# EAGLE design TestBench_rev3 (EAGLE 6.4)
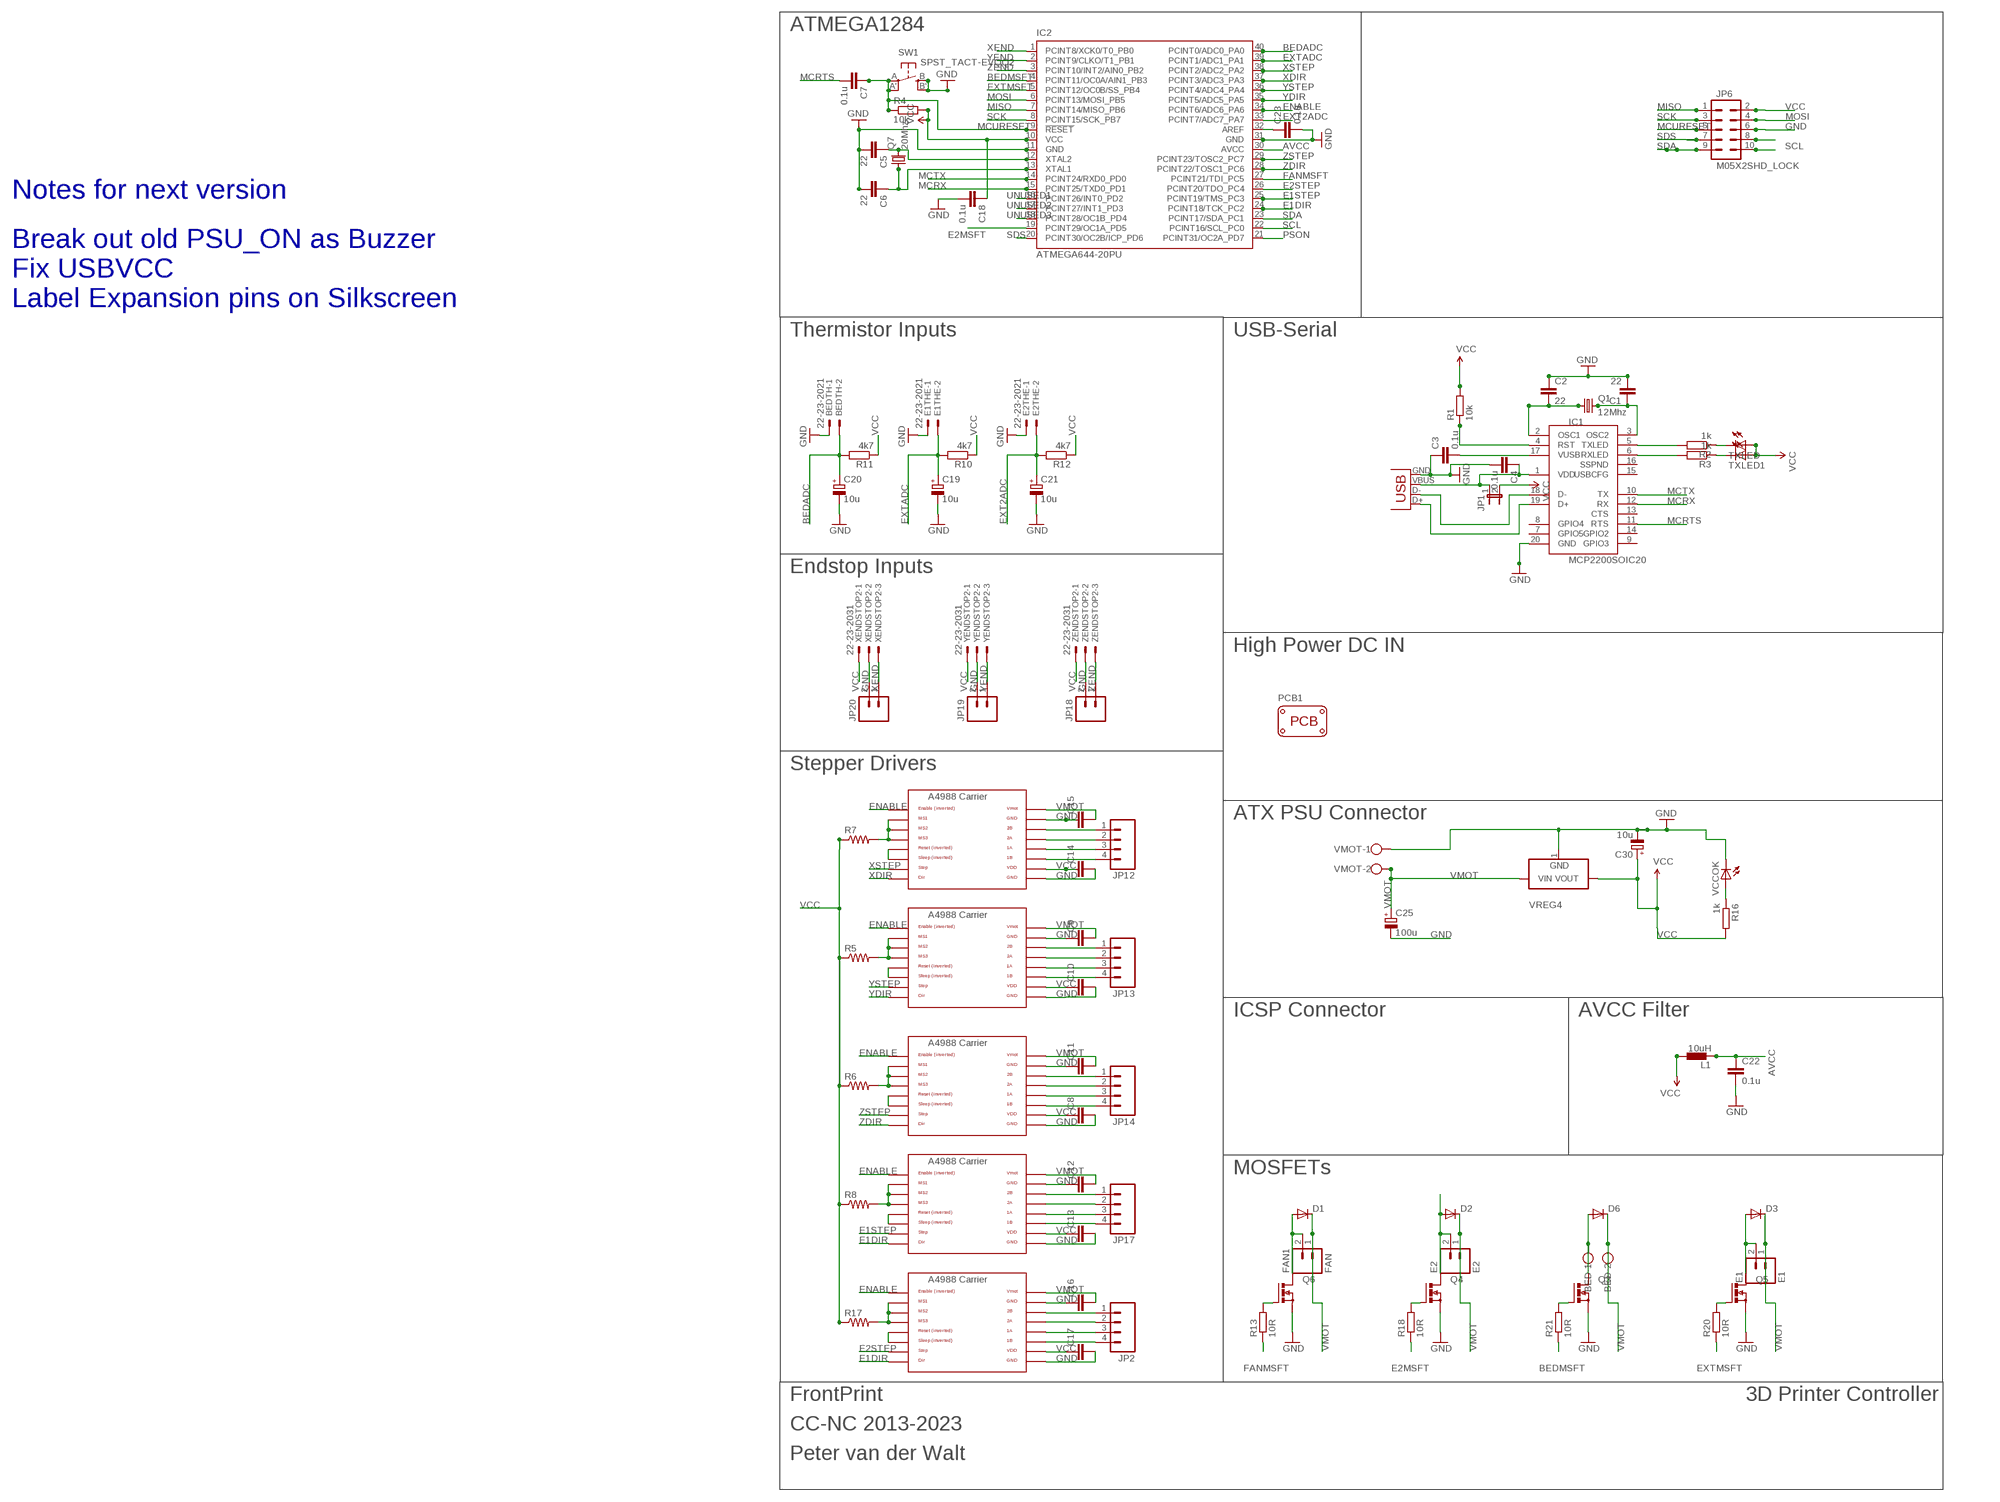
[diagram p0: schematic, sheet 1]

## Parts
BED  W237-102  [W237-102]
BEDTH  22-23-2021  [22-23-2021]
C1  22  CAP1206  [1206]
C2  22  CAP1206  [1206]
C3  0.1u  CAP1206  [1206]
C4  0.1u  CAP1206  [1206]
C5  22  CAP1206  [1206]
C6  22  CAP1206  [1206]
C7  0.1u  CAP1206  [1206]
C8  CAP1206  [1206]
C9  CAP1206  [1206]
C10  CAP1206  [1206]
C11  CAP1206  [1206]
C12  CAP1206  [1206]
C13  CAP1206  [1206]
C14  CAP1206  [1206]
C15  CAP1206  [1206]
C16  CAP1206  [1206]
C17  CAP1206  [1206]
C18  0.1u  CAP1206  [1206]
C19  10u  CPOL-EUE2.5-5  [E2,5-5]
C20  10u  CPOL-EUE2.5-5  [E2,5-5]
C21  10u  CPOL-EUE2.5-5  [E2,5-5]
C22  0.1u  CAP1206  [1206]
C23  0.1u  CAP1206  [1206]
C25  100u  CPOL-EUE5-8.5  [E5-8,5]
C30  10u  CPOL-EUE2-5  [E2-5]
D1  DIODESMA-ALT  [SMA-DIODE_ALT]
D2  DIODESMA-ALT  [SMA-DIODE_ALT]
D3  DIODESMA-ALT  [SMA-DIODE_ALT]
D6  DIODESMA-ALT  [SMA-DIODE_ALT]
E1  E1  M023.5MM  [SCREWTERMINAL-3.5MM-2]
E1POL  POLOLU_A4983CARRIER  [A4988BREAKOUT]
E1THE  22-23-2021  [22-23-2021]
E2  E2  M023.5MM  [SCREWTERMINAL-3.5MM-2]
E2POL  POLOLU_A4983CARRIER  [A4988BREAKOUT]
E2THE  22-23-2021  [22-23-2021]
FAN1  FAN  M023.5MM  [SCREWTERMINAL-3.5MM-2]
IC1  MCP2200SOIC20  [SOIC20]
IC2  ATMEGA644-20PU  [DIL40]
JP1  JUMPER-2PTH_LOCK  [1X02_LOCK]
JP2  M04SCREW  [SCREWTERMINAL-3.5MM-4]
JP6  M05X2SHD_LOCK  [2X5-SHROUDED_LOCK]
JP12  M04SCREW  [SCREWTERMINAL-3.5MM-4]
JP13  M04SCREW  [SCREWTERMINAL-3.5MM-4]
JP14  M04SCREW  [SCREWTERMINAL-3.5MM-4]
JP17  M04SCREW  [SCREWTERMINAL-3.5MM-4]
JP18  M023.5MM  [SCREWTERMINAL-3.5MM-2]
JP19  M023.5MM  [SCREWTERMINAL-3.5MM-2]
JP20  M023.5MM  [SCREWTERMINAL-3.5MM-2]
L1  10uH  BL01RN1A  [BL01RN1A]
PCB1  PCB_DP_SQUARE-10X10  [DP100100_V1]
Q1  12Mhz  CRYSTALHC49UP  [HC49UP]
Q3  PMOSFET_NTO220BV  [TO220BV]
Q4  PMOSFET_NTO220BV  [TO220BV]
Q5  PMOSFET_NTO220BV  [TO220BV]
Q6  PMOSFET_NTO220BV  [TO220BV]
Q7  20Mhz  CRYSTALHC49UP  [HC49UP]
R1  10k  R-EU_M1206  [M1206]
R2  1k  R-EU_M1206  [M1206]
R3  1k  R-EU_M1206  [M1206]
R4  10k  R-EU_M1206  [M1206]
R5  RESISTOR1206  [1206]
R6  RESISTOR1206  [1206]
R7  RESISTOR1206  [1206]
R8  RESISTOR1206  [1206]
R10  4k7  R-EU_M1206  [M1206]
R11  4k7  R-EU_M1206  [M1206]
R12  4k7  R-EU_M1206  [M1206]
R13  10R  R-EU_M1206  [M1206]
R16  1k  R-EU_M1206  [M1206]
R17  RESISTOR1206  [1206]
R18  10R  R-EU_M1206  [M1206]
R20  10R  R-EU_M1206  [M1206]
R21  10R  R-EU_M1206  [M1206]
SW1  SPST_TACT-EVQQ2  [EVQ-Q2]
TXLED  LEDSMT1206  [1206]
TXLED1  LEDSMT1206  [1206]
VCCOK  LEDSMT1206  [1206]
VMOT  W237-102  [W237-102]
VREG4  VREG_3PINS-DPAK  [DPAK]
X1  USBPTH  [USB-B-PTH]
XENDSTOP2  22-23-2031  [22-23-2031]
XPOL  POLOLU_A4983CARRIER  [A4988BREAKOUT]
YENDSTOP2  22-23-2031  [22-23-2031]
YPOL  POLOLU_A4983CARRIER  [A4988BREAKOUT]
ZENDSTOP2  22-23-2031  [22-23-2031]
ZPOL  POLOLU_A4983CARRIER  [A4988BREAKOUT]

## Nets
AVCC: C22.1 IC2.30(AVCC) L1.1
BEDADC: BEDTH.2 C20.+ IC2.40(PCINT0/ADC0_PA0) R11.2
BEDMSFT: IC2.4(PCINT11/OC0A/AIN1_PB3) R21.1
BEDOUT1: BED.1 D6.A Q3.D
BEDOUT2: D3.A E1.2 Q5.D
E1DIR: E1POL.DIR E2POL.DIR IC2.24(PCINT18/TCK_PC2)
E1OUT1: D2.A E2.2 Q4.D
E1STEP: E1POL.STEP IC2.25(PCINT19/TMS_PC3)
E2MSFT: IC2.19(PCINT29/OC1A_PD5) R18.1
E2STEP: E2POL.STEP IC2.26(PCINT20/TDO_PC4)
ENABLE: E1POL.EN E2POL.EN IC2.34(PCINT6/ADC6_PA6) XPOL.EN YPOL.EN ZPOL.EN
EXT2ADC: C21.+ E2THE.2 IC2.33(PCINT7/ADC7_PA7) R12.2
EXTADC: C19.+ E1THE.2 IC2.39(PCINT1/ADC1_PA1) R10.2
EXTMSFT: IC2.5(PCINT12/OC0B/SS_PB4) R20.1
FANMSFT: IC2.27(PCINT21/TDI_PC5) R13.1
FANOUT1: D1.A FAN1.2 Q6.D
GND: BEDTH.1 C1.2 C2.1 C3.1 C4.2 C5.2 C6.2 C8.2 C9.1 C10.2 C11.1 C12.1 C13.2 C14.2 C15.1 C16.1 C17.2 C18.2 C19.- C20.- C21.- C22.2 C23.2 C25.- C30.- E1POL.GND E1POL.GND@0(GND) E1THE.1 E2POL.GND E2POL.GND@0(GND) E2THE.1 IC1.20(GND) IC2.11(GND) IC2.31(GND) JP6.6 JP18.2 JP19.2 JP20.2 Q3.S Q4.S Q5.S Q6.S SW1.B'(S1) SW1.B(S) VCCOK.C VMOT.1 VREG4.1(GND) X1.GND XENDSTOP2.2 XPOL.GND XPOL.GND@0(GND) YENDSTOP2.2 YPOL.GND YPOL.GND@0(GND) ZENDSTOP2.2 ZPOL.GND ZPOL.GND@0(GND)
MCRTS: C7.2 IC1.11(RTS)
MCRX: IC1.12(RX) IC2.15(PCINT25/TXD0_PD1)
MCTX: IC1.10(TX) IC2.14(PCINT24/RXD0_PD0)
MCURESET: C7.1 IC2.9(!RESET) JP6.5 R4.1 SW1.A'(P1) SW1.A(P)
MISO: IC2.7(PCINT14/MISO_PB6) JP6.1
MOSI: IC2.6(PCINT13/MOSI_PB5) JP6.4
N$1: C2.2 IC1.2(OSC1) Q1.1
N$2: C1.1 IC1.3(OSC2) Q1.2
N$3: IC1.5(TXLED) R2.2
N$4: IC1.18(D-) X1.D-
N$5: IC1.19(D+) X1.D+
N$6: IC1.6(RXLED) R3.2
N$7: C3.2 IC1.17(VUSB)
N$8: E2POL.RST E2POL.SLP(SLEEP)
N$9: R2.1 TXLED.C
N$10: R3.1 TXLED1.C
N$11: C5.1 IC2.12(XTAL2) Q7.2
N$12: C6.1 IC2.13(XTAL1) Q7.1
N$13: IC1.4(RST) R1.1
N$14: E1POL.RST E1POL.SLP(SLEEP)
N$15: ZPOL.RST ZPOL.SLP(SLEEP)
N$16: YPOL.RST YPOL.SLP(SLEEP)
N$17: XPOL.RST XPOL.SLP(SLEEP)
N$18: R7.2 XPOL.MS1 XPOL.MS2 XPOL.MS3
N$19: R5.2 YPOL.MS1 YPOL.MS2 YPOL.MS3
N$20: E1POL.MS1 E1POL.MS2 E1POL.MS3 R8.2
N$21: R6.2 ZPOL.MS1 ZPOL.MS2 ZPOL.MS3
N$22: E1POL.1B JP17.4
N$23: E1POL.1A JP17.3
N$24: E1POL.2A JP17.2
N$25: E1POL.2B JP17.1
N$26: JP14.4 ZPOL.1B
N$27: JP14.3 ZPOL.1A
N$28: JP14.2 ZPOL.2A
N$29: JP14.1 ZPOL.2B
N$30: JP13.1 YPOL.2B
N$31: JP13.2 YPOL.2A
N$32: JP13.3 YPOL.1A
N$33: JP13.4 YPOL.1B
N$34: JP12.4 XPOL.1B
N$35: JP12.3 XPOL.1A
N$36: JP12.2 XPOL.2A
N$37: JP12.1 XPOL.2B
N$41: E2POL.MS1 E2POL.MS2 E2POL.MS3 R17.2
N$42: E2POL.1B JP2.4
N$43: E2POL.1A JP2.3
N$44: E2POL.2A JP2.2
N$45: E2POL.2B JP2.1
N$46: Q5.G R20.2
N$54: C23.1 IC2.32(AREF)
N$55: Q6.G R13.2
N$58: C4.1 IC1.1(VDD) JP1.1 X1.VBUS
N$61: Q4.G R18.2
N$64: R16.1 VCCOK.A
N$67: Q3.G R21.2
N$73: JP6.8
PSON: IC2.21(PCINT31/OC2A_PD7)
SCK: IC2.8(PCINT15/SCK_PB7) JP6.3
SCL: IC2.22(PCINT16/SCL_PC0) JP6.10
SDA: IC2.23(PCINT17/SDA_PC1) JP6.9
SDS: IC2.20(PCINT30/OC2B/ICP_PD6) JP6.7
UNUSED1: IC2.16(PCINT26/INT0_PD2)
UNUSED2: IC2.17(PCINT27/INT1_PD3)
UNUSED3: IC2.18(PCINT28/OC1B_PD4)
VCC: C8.1 C10.1 C13.1 C14.1 C17.1 C18.1 C30.+ E1POL.VDD E2POL.VDD IC2.10(VCC) JP1.2 JP6.2 L1.2 R1.2 R4.2 R5.1 R6.1 R7.1 R8.1 R10.1 R11.1 R12.1 R16.2 R17.1 TXLED1.A TXLED.A VREG4.2(VOUT) XENDSTOP2.1 XPOL.VDD YENDSTOP2.1 YPOL.VDD ZENDSTOP2.1 ZPOL.VDD
VMOT: BED.2 C9.2 C11.2 C12.2 C15.2 C16.2 C25.+ D1.C D2.C D3.C D6.C E1.1 E1POL.VMOT E2.1 E2POL.VMOT FAN1.1 VMOT.2 VREG4.3(VIN) XPOL.VMOT YPOL.VMOT ZPOL.VMOT
XDIR: IC2.37(PCINT3/ADC3_PA3) XPOL.DIR
XEND: IC2.1(PCINT8/XCK0/T0_PB0) JP20.1 XENDSTOP2.3
XSTEP: IC2.38(PCINT2/ADC2_PA2) XPOL.STEP
YDIR: IC2.35(PCINT5/ADC5_PA5) YPOL.DIR
YEND: IC2.2(PCINT9/CLKO/T1_PB1) JP19.1 YENDSTOP2.3
YSTEP: IC2.36(PCINT4/ADC4_PA4) YPOL.STEP
ZDIR: IC2.28(PCINT22/TOSC1_PC6) ZPOL.DIR
ZEND: IC2.3(PCINT10/INT2/AIN0_PB2) JP18.1 ZENDSTOP2.3
ZSTEP: IC2.29(PCINT23/TOSC2_PC7) ZPOL.STEP
Unconnected: IC1.7(GPIO5) IC1.8(GPIO4) IC1.9(GPIO3) IC1.13(CTS) IC1.14(GPIO2) IC1.15(USBCFG) IC1.16(SSPND)

## Notes on the sheet
- ATMEGA1284
- Notes for next version
- Break out old PSU_ON as Buzzer
- Fix USBVCC
- Label Expansion pins on Silkscreen
- Thermistor Inputs | USB-Serial
- Endstop Inputs
- High Power DC IN
- Stepper Drivers
- ATX PSU Connector
- ICSP Connector | AVCC Filter
- MOSFETs
- FrontPrint | 3D Printer Controller
- CC-NC 2013-2023
- Peter van der Walt

## Library data of the parts
BED VMOT = con-wago-500:W237-102: WAGO SCREW CLAMP; MPN: 237-102; OC_FARNELL: unknown; OC_NEWARK: 70K9898
BEDTH E1THE E2THE = con-molex:22-23-2021: .100" (2.54mm) Center Header - 2 Pin; MF: MOLEX; MPN: 22-23-2021; OC_FARNELL: 1462926; OC_NEWARK: 25C3832
C1-C18 C22 C23 = SparkFun-Passives:CAP: Capacitor Standard 0603 ceramic capacitor, and 0.1" leaded capacitor.
C19-C21 C25 C30 = rcl:CPOL-EU: POLARIZED CAPACITOR, European symbol
D1-D3 D6 = SparkFun-DiscreteSemi:DIODE: Diode These are standard reverse protection diodes and small signal diodes. SMA package can handle up to about 1A. SOD-323 can handle about 200mA. What the SOD-323 package when ordering, there are some mfgs out there that are 5-pin packages.
E1 E2 FAN1 JP18-JP20 = SparkFun-Connectors:M02: Header 2 Standard 2-pin 0.1" header. Use with straight break away headers (SKU : PRT-00116), right angle break away headers (PRT-00553), swiss pins (PRT-00743), machine pins (PRT-00117), and female headers (PRT-00115). Molex polarized connector foot print use with SKU : PRT-08233 with associated crimp pins and housings.
E1POL E2POL XPOL YPOL ZPOL = RepRapjr:POLOLU_A4983CARRIER
IC1 = microchip-update-2:MCP2200: USB 2.0 to UART Protocol Converter with GPIO
IC2 = atmel:ATMEGA644-*PU: 8-bit Microcontroller with 64K Bytes In-System Programmable Flash Auto generated by make-symbol-device-package-bsdl.ulp Rev. 34 Source: http://www.atmel.com/dyn/resources/prod_documents/doc2593.pdf; MPN: ATMEGA644-20PU; OC_FARNELL: 1288340; OC_NEWARK: 23M5060
JP1 = SparkFun-Passives:JUMPER-2: Jumper Basic 0.1" spaced jumper. Use with breakaway headers.
JP2 JP12-JP14 JP17 = SparkFun-Connectors:M04: Header 4 Standard 4-pin 0.1" header. Use with straight break away headers (SKU : PRT-00116), right angle break away headers (PRT-00553), swiss pins (PRT-00743), machine pins (PRT-00117), and female headers (PRT-00115). Molex polarized connector foot print use with SKU : PRT-08231 with associated crimp pins and housings. 1MM SMD Version SKU: PRT-10208
JP6 = SparkFun-Connectors:M05X2: Header 5x2 Standard 10-pin dual row 0.1" header. Commonly used with AVR-ISP. Use with Spark Fun Electronics SKU: PRT-00778
L1 = inductors:BL0: Noise Suppression Products/EMI Suppression Filters, Lead EMIFIL(R) Inductor Type Source: http://www.murata.com .. BL01RN1_DS.pdf
PCB1 = dp_devices:PCB_DP_SQUARE: Dangerous Prototypes Standard Square PCB sizes
Q1 Q7 = adafruit:CRYSTAL: CRYSTAL; OC_FARNELL: unknown; OC_NEWARK: unknown
Q3-Q6 = transistor-power:PMOSFET_N: Power MOSFET N-Channel
R1-R4 R10-R13 R16 R18 R20 R21 = resistor:R-EU_: RESISTOR, European symbol
R5-R8 R17 = SparkFun-Passives:RESISTOR: Resistor Basic schematic elements and footprints for 0603, 1206, and PTH resistors.
SW1 = adafruit:SPST_TACT: SMT 6mm switch, EVQQ2 series http://www.ladyada.net/library/eagle
TXLED TXLED1 VCCOK = led:LED: LED OSRAM: - CHIPLED LG R971, LG N971, LY N971, LG Q971, LY Q971, LO R971, LY R971 LH N974, LH R974 LS Q976, LO Q976, LY Q976 LO Q996 - Hyper CHIPLED LW Q18S LB Q993, LB Q99A, LB R99A - SideLED LS A670, LO A670, LY A670, LG A670, LP A670 LB A673, LV A673, LT A673, LW A673 LH A674 LY A675 LS A676, LA A676, LO A676, LY A676, LW A676 LS A679, LY A679, LG A679 - Hyper Micro SIDELED® LS Y876, LA Y876, LO Y876, LY Y876 LT Y87S - SmartLED LW L88C, LW L88S LB L89C, LB L89S, LG L890 LS L89K, LO L89K, LY L89K LS L896, LA L896, LO L896, LY L896 - TOPLED LS T670, LO T670, LY T670, LG T670, LP T670 LSG T670, LSP T670, LSY T670, LOP T670, LYG T670 LG T671, LOG T671, LSG T671 LB T673, LV T673, LT T673, LW T673 LH T674 LS T676, LA T676, LO T676, LY T676, LB T676, LH T676, LSB T676, LW T676 LB T67C, LV T67C, LT T67C, LS T67K, LO T67K, LY T67K, LW E67C LS E67B, LA E67B, LO E67B, LY E67B, LB E67C, LV E67C, LT E67C LW T67C LS T679, LY T679, LG T679 LS T770, LO T770, LY T770, LG T770, LP T770 LB T773, LV T773, LT T773, LW T773 LH T774 LS E675, LA E675, LY E675, LS T675 LS T776, LA T776, LO T776, LY T776, LB T776 LHGB T686 LT T68C, LB T68C - Hyper Mini TOPLED® LB M676 - Mini TOPLED Santana® LG M470 LS M47K, LO M47K, LY M47K Source: http://www.osram.convergy.de LUXEON: - LUMILED® LXK2-PW12-R00, LXK2-PW12-S00, LXK2-PW14-U00, LXK2-PW14-V00 LXK2-PM12-R00, LXK2-PM12-S00, LXK2-PM14-U00 LXK2-PE12-Q00, LXK2-PE12-R00, LXK2-PE12-S00, LXK2-PE14-T00, LXK2-PE14-U00 LXK2-PB12-K00, LXK2-PB12-L00, LXK2-PB12-M00, LXK2-PB14-N00, LXK2-PB14-P00, LXK2-PB14-Q00 LXK2-PR12-L00, LXK2-PR12-M00, LXK2-PR14-Q00, LXK2-PR14-R00 LXK2-PD12-Q00, LXK2-PD12-R00, LXK2-PD12-S00 LXK2-PH12-R00, LXK2-PH12-S00 LXK2-PL12-P00, LXK2-PL12-Q00, LXK2-PL12-R00 Source: www.luxeon.com KINGBRIGHT: KA-3528ASYC Source: www.kingbright.com
VREG4 = dp_devices:VREG_3PINS: Various 3 pin voltage regulators in different packages Double check the right pinout for the right part
X1 = SparkFun-Connectors:USB: USB Connectors USB-B-PTH is fully proven SKU : PRT-00139 USB-miniB is fully proven SKU : PRT-00587 USB-A-PCB is untested. USB-A-H is throughly reviewed, but untested. Spark Fun Electronics SKU : PRT-00437 USB-B-SMT is throughly reviewed, but untested. Needs silkscreen touching up. USB-A-S has not been used/tested USB-MB-H has not been used/tested
XENDSTOP2 YENDSTOP2 ZENDSTOP2 = con-molex:22-23-2031: .100" (2.54mm) Center Header - 3 Pin; MF: MOLEX; MPN: 22-23-2031; OC_FARNELL: 1462950; OC_NEWARK: 30C0862

## Board
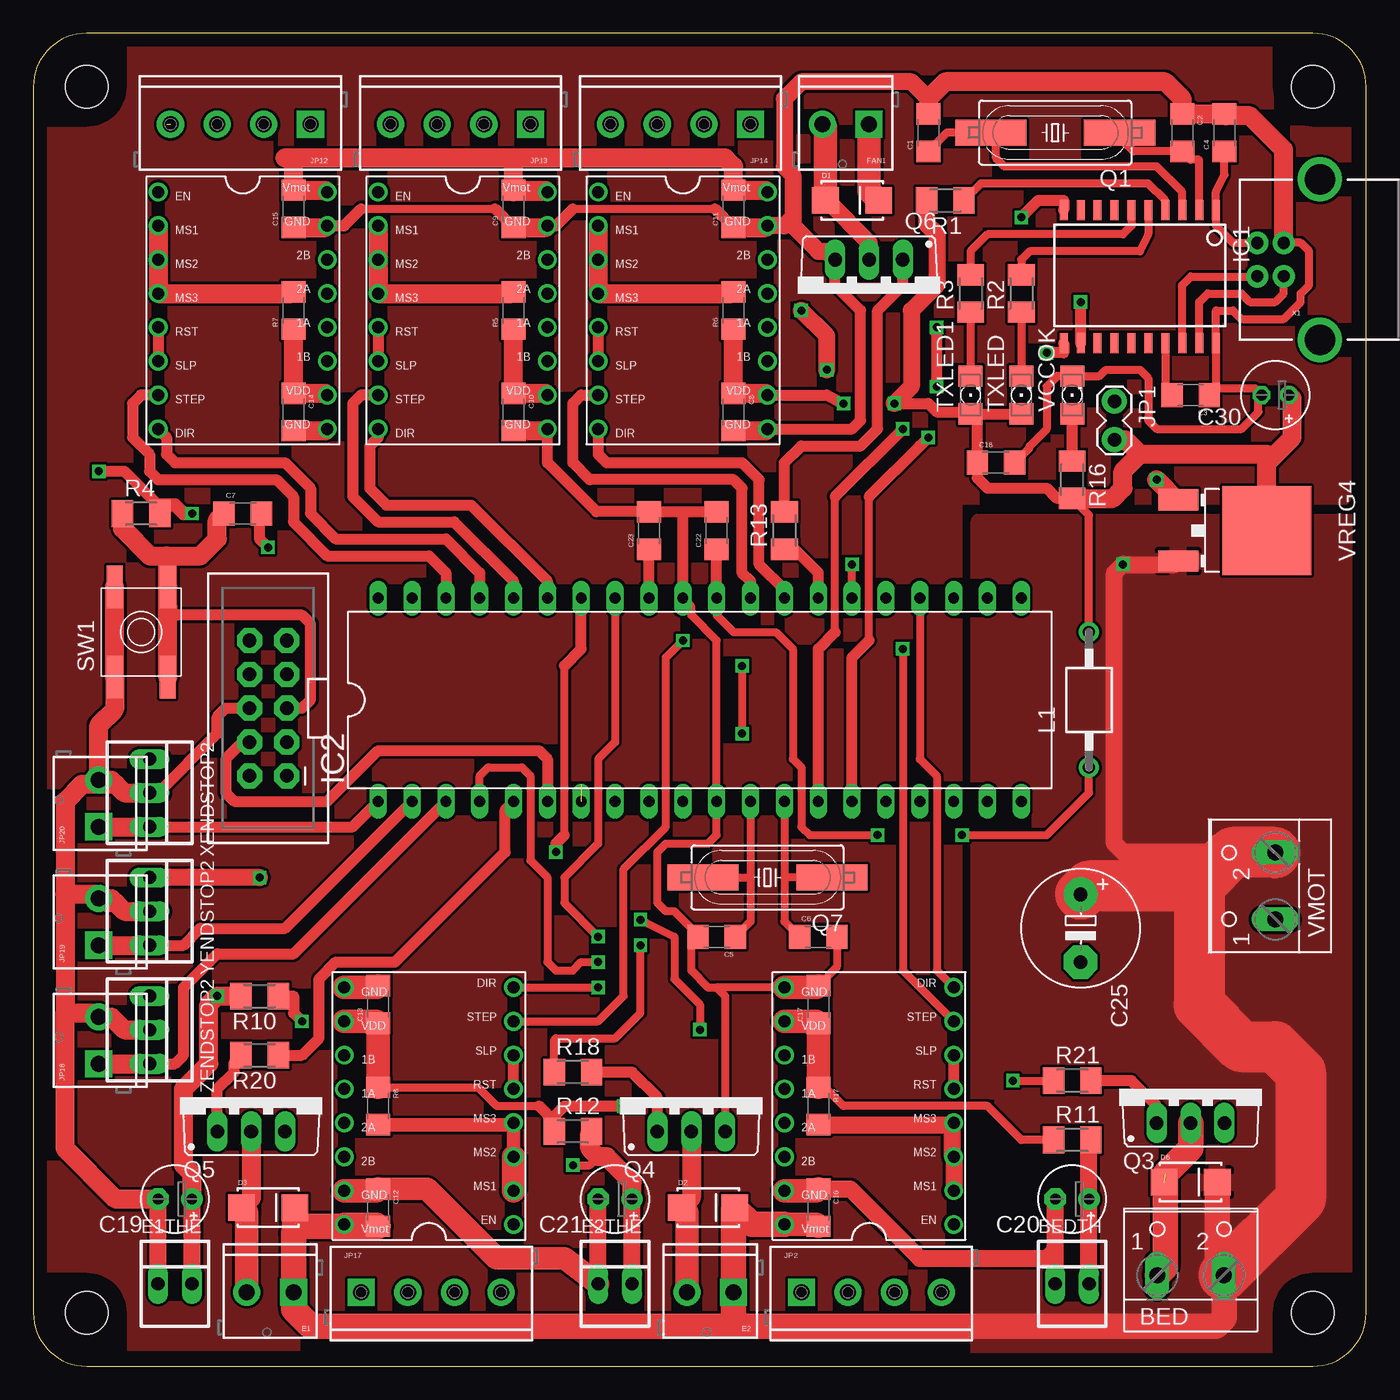
[diagram p1: board, top side]
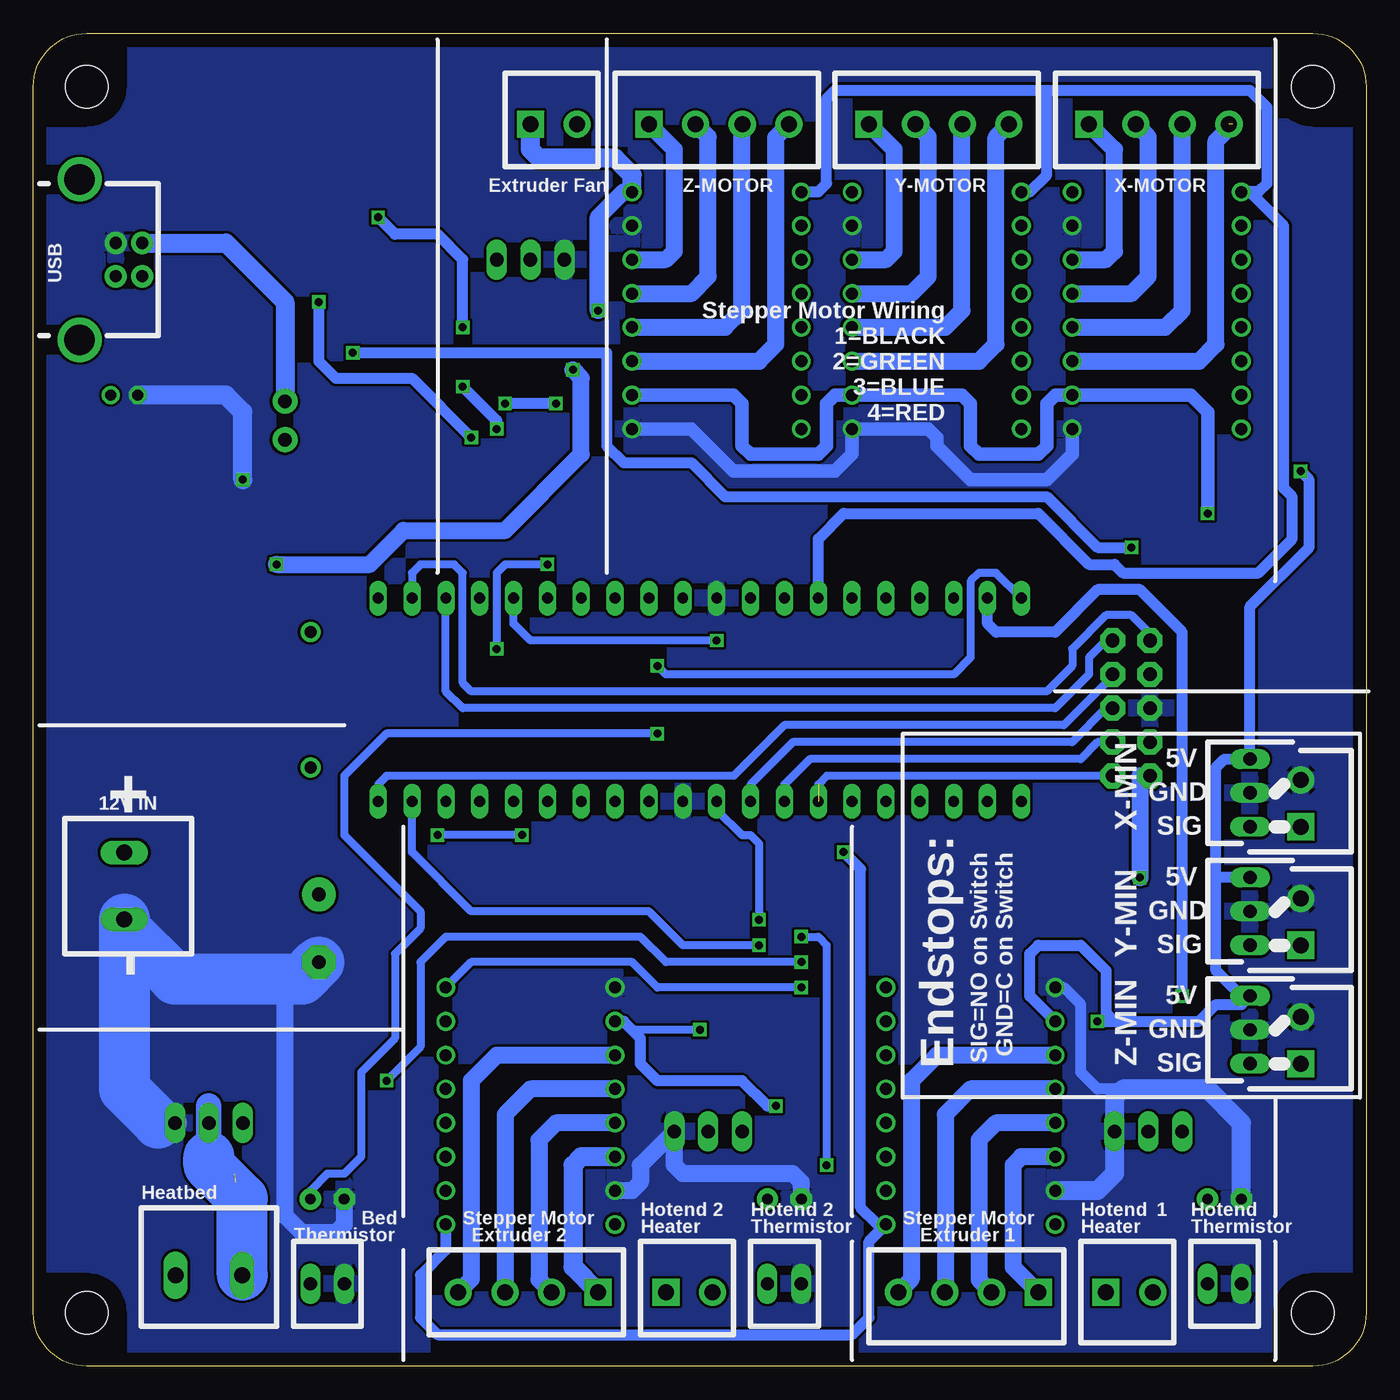
[diagram p2: board, bottom side, seen from below]

Size 100 x 100 mm. Coordinates in mm from the lower left corner, seen from the top.
Copper layers (1*16): Top 0.035mm / dielectric 1.5mm / Bottom 0.035mm
Design rules "default": minimum track width 10mil, minimum drill 24mil, track to track 8mil, track to pad 8mil, pad to pad 8mil, via to via 8mil, smd to smd 8mil, copper to edge 40mil, drill to drill 8mil, minimum pad ring 10mil, minimum via ring 8mil, stop-mask expansion 4mil, vias tented up to drill 0mil, thermal gap 10mil

### Footprints (pad centres in the part's own frame; a part is rotated, then mirrored left to right if it is on the bottom)
W237-102 = drill 1.194 long: 1 -2.5,-1.27; 2 2.5,-1.27
22-23-2021 = drill 1 long: 1 -1.27,0; 2 1.27,0
1206 = smd 1.6 x 1.8: 1 -1.4,0; 2 1.4,0
E2,5-5 = drill 0.813 pad 1.6: + -1.27,0 | drill 0.813 pad 1.6 octagon: - 1.27,0
E5-8,5 = drill 1.016 pad 2.54: + -2.54,0 | drill 1.016 pad 2.54 octagon: - 2.54,0
E2-5 = drill 0.813 pad 1.27: + -1.016,0 | drill 0.813 pad 1.27 octagon: - 1.016,0
SMA-DIODE_ALT = smd 2 x 2: A -2,0; C 2,0
SCREWTERMINAL-3.5MM-2 = drill 1.2 pad 2.032 square: 1 0,0 | drill 1.2 pad 2.032: 2 3.5,0
A4988BREAKOUT = drill 0.9: 1A 8.89,1.27; 1B 11.43,1.27; 2A 6.35,1.27; 2B 3.81,1.27; DIR 16.51,-11.43; EN -1.27,-11.43; GND 16.51,1.27; GND@0 1.27,1.27; MS1 1.27,-11.43; MS2 3.81,-11.43; MS3 6.35,-11.43; RST 8.89,-11.43; SLP 11.43,-11.43; STEP 13.97,-11.43; VDD 13.97,1.27; VMOT -1.27,1.27
SOIC20 = smd 0.6 x 1.5: 1 -5.715,-5; 2 -4.445,-5; 3 -3.175,-5; 4 -1.905,-5; 5 -0.635,-5; 6 0.635,-5; 7 1.905,-5; 8 3.175,-5; 9 4.445,-5; 10 5.715,-5; 11 5.715,5; 12 4.445,5; 13 3.175,5; 14 1.905,5; 15 0.635,5; 16 -0.635,5; 17 -1.905,5; 18 -3.175,5; 19 -4.445,5; 20 -5.715,5
DIL40 = drill 0.813 long: 1 -24.13,-7.62; 2 -21.59,-7.62; 3 -19.05,-7.62; 4 -16.51,-7.62; 5 -13.97,-7.62; 6 -11.43,-7.62; 7 -8.89,-7.62; 8 -6.35,-7.62; 9 -3.81,-7.62; 10 -1.27,-7.62; 11 1.27,-7.62; 12 3.81,-7.62; 13 6.35,-7.62; 14 8.89,-7.62; 15 11.43,-7.62; 16 13.97,-7.62; 17 16.51,-7.62; 18 19.05,-7.62; 19 21.59,-7.62; 20 24.13,-7.62; 21 24.13,7.62; 22 21.59,7.62; 23 19.05,7.62; 24 16.51,7.62; 25 13.97,7.62; 26 11.43,7.62; 27 8.89,7.62; 28 6.35,7.62; 29 3.81,7.62; 30 1.27,7.62; 31 -1.27,7.62; 32 -3.81,7.62; 33 -6.35,7.62; 34 -8.89,7.62; 35 -11.43,7.62; 36 -13.97,7.62; 37 -16.51,7.62; 38 -19.05,7.62; 39 -21.59,7.62; 40 -24.13,7.62
1X02_LOCK = drill 1.016 pad 1.88: 1 -0.178,0; 2 2.718,0
SCREWTERMINAL-3.5MM-4 = drill 1.2 pad 2.032 square: 1 0,0 | drill 1.2 pad 2.032: 2 3.5,0; 3 7,0; 4 10.5,0
2X5-SHROUDED_LOCK = drill 1.016 pad 1.88 octagon: 1 -1.397,5.08; 2 1.397,5.08; 3 -1.397,2.54; 4 1.397,2.54; 5 -1.397,0; 6 1.397,0; 7 -1.397,-2.54; 8 1.397,-2.54; 9 -1.397,-5.08; 10 1.397,-5.08
BL01RN1A = drill 0.9 pad 1.5: 1 -5.08,0; 2 5.08,0
DP100100_V1 = hole 3.2: -46,-46; 46,-46; 46,46; -46,46
HC49UP = smd 5.334 x 1.93: 1 -4.826,0; 2 4.826,0
TO220BV = drill 1.016 long: D 0,-2.54; G -2.54,-2.54; S 2.54,-2.54
M1206 = smd 1.6 x 2: 1 -1.4,0; 2 1.4,0
EVQ-Q2 = smd 3.2 x 1.2: A -3.4,-2; A' 3.4,-2; B -3.4,2; B' 3.4,2
1206' = smd 1.6 x 1.803: A -1.422,0; C 1.422,0
DPAK = smd 1.6 x 3: 1 -2.3,-6.65; 3 2.3,-6.65 | smd 6.7 x 6.7: 2 0,0
USB-B-PTH = drill 0.914 pad 1.676: D+ 0,1.25; D- 1.981,1.25; GND 0,-1.25; VBUS 1.981,-1.25 | drill 2.286: S1 -2.718,-6.02; S2 -2.718,6.02
22-23-2031 = drill 1 long: 1 -2.54,0; 2 0,0; 3 2.54,0

### Placement (x,y rotation side)
BED  86.83,8.09 0 top
BEDTH  77.94,6.19 0 top
C1  67.15,92.55 90 top
C2  86.2,92.55 270 top
C3  86.83,72.86 180 top
C4  89.37,92.55 90 top
C5  51.27,32.22 180 top
C6  58.89,32.22 0 top
C7  15.71,63.97 0 top
C8  52.54,71.59 270 top
C9  36.03,86.83 90 top
C10  36.03,71.59 270 top
C11  52.54,86.83 90 top
C12  25.87,11.9 270 top
C13  25.87,27.14 90 top
C14  19.52,71.59 270 top
C15  19.52,86.83 90 top
C16  58.89,11.9 270 top
C17  58.89,27.14 90 top
C18  72.23,67.78 0 top
C19  10.63,12.54 180 top
C20  77.94,12.54 180 top
C21  43.65,12.54 180 top
C22  51.27,62.7 90 top
C23  46.19,62.7 90 top
C25  78.58,32.86 270 top
C30  93.18,72.86 180 top
D1  61.43,87.47 0 top
D2  50.64,11.9 0 top
D3  17.62,11.9 0 top
D6  86.83,13.81 0 top
E1  19.52,5.55 180 top
E1POL  24.6,11.9 90 top
E1THE  10.63,6.19 0 top
E2  52.54,5.55 180 top
E2POL  57.62,11.9 90 top
E2THE  43.65,6.19 0 top
FAN1  62.7,93.18 180 top
IC1  83.02,81.75 180 top
IC2  50,50 0 top
JP1  81.12,72.23 270 top
JP2  57.62,5.55 0 top
JP6  17.62,49.37 180 top
JP12  20.79,93.18 180 top
JP13  37.3,93.18 180 top
JP14  53.81,93.18 180 top
JP17  24.6,5.55 0 top
JP18  4.92,22.7 90 top
JP19  4.92,31.59 90 top
JP20  4.92,40.48 90 top
L1  79.21,50 90 top
PCB1  50,50 0 top
Q1  76.67,92.55 180 top
Q3  86.83,20.79 0 top
Q4  49.37,20.16 0 top
Q5  16.35,20.16 0 top
Q6  62.7,80.48 180 top
Q7  55.08,36.66 180 top
R1  68.42,87.47 180 top
R2  74.13,80.48 90 top
R3  70.32,80.48 90 top
R4  8.09,63.97 0 top
R5  36.03,79.21 90 top
R6  52.54,79.21 90 top
R7  19.52,79.21 90 top
R8  25.87,19.52 270 top
R10  16.98,27.78 180 top
R11  77.94,16.98 0 top
R12  40.48,17.62 0 top
R13  56.35,62.7 90 top
R16  77.94,66.51 270 top
R17  58.89,19.52 270 top
R18  40.48,22.06 0 top
R20  16.98,23.33 180 top
R21  77.94,21.43 0 top
SW1  8.09,55.08 90 top
TXLED  [1206']  74.13,72.86 90 top
TXLED1  [1206']  70.32,72.86 90 top
VCCOK  [1206']  77.94,72.86 90 top
VMOT  91.91,36.03 90 top
VREG4  92.55,62.7 270 top
X1  93.82,83.02 180 top
XENDSTOP2  8.73,43.02 270 top
XPOL  20.79,86.83 270 top
YENDSTOP2  8.73,34.12 270 top
YPOL  37.3,86.83 270 top
ZENDSTOP2  8.73,25.23 270 top
ZPOL  53.81,86.83 270 top

### Tracks (layer width: path | path; a pad name or v marks a point on that pad's centre or on a via)
AVCC  (via drill 0.6)
  Top 0.61: IC2.30 51.27,56.35 52.54,55.08 55.72,55.08 56.99,53.81 56.99,45.55 57.62,44.92 57.62,40.48 58.26,39.84 v63.34,39.84 | v69.69,39.84 76.03,39.84 79.21,43.02 L1.1
  Top 0.813: IC2.30 C22.1
  Bottom 0.61: v63.34,39.84 v69.69,39.84
BEDADC  (via drill 0.6)
  Top 0.61: v53.18,52.54 v53.18,47.46
  Top 1.27: BEDTH.2 C20.+ 79.21,16.85 R11.2
  Bottom 0.61: IC2.40 27.78,59.53 29.05,59.53 29.68,58.89 29.68,53.18 30.95,51.91 52.54,51.91 v53.18,52.54 | v53.18,47.46 73.5,47.46 76.67,44.29 76.67,39.84 70.96,34.12 70.96,32.86 72.86,30.95 72.86,24.6 75.4,22.06 75.4,15.71 76.67,14.44 77.94,14.44 79.21,13.17 C20.+
BEDMSFT  (via drill 0.6)
  Top 0.61: IC2.4 33.49,44.29 34.12,44.92 36.67,44.92 37.3,44.29 37.3,37.94 38.57,36.66 38.57,30.32 39.21,29.68 40.48,29.68 41.11,30.32 v42.38,30.32 | v73.5,21.43 R21.1
  Bottom 0.61: v42.38,30.32 52.54,30.32 54.45,32.22 69.05,32.22 70.96,30.32 70.96,23.97 v73.5,21.43
BEDOUT1  (1 unrouted)
  Top 1.93: Q3.D 86.83,16.35 84.93,14.44 84.93,7.42 BED.1
  Bottom 1.93: 86.83,15.71 86.83,19.52
  Bottom 3.81: BED.1 84.33,12.58 86.83,15.08 86.83,15.71
BEDOUT2
  Top 1.422: Q5.D 16.35,12.63 D3.A
  Top 1.778: E1.2 16.02,11.5 D3.A
E1DIR  (via drill 0.6)
  Top 0.61: IC2.24 66.51,45.55 67.78,44.29 67.78,29.68 E2POL.DIR | E1POL.DIR v42.38,28.41
  Bottom 0.61: v42.38,28.41 53.18,28.41 55.08,30.32 67.15,30.32 E2POL.DIR
E1OUT1
  Top 1.422: Q4.D 49.37,12.63 D2.A
  Top 1.778: E2.2 49.04,11.5 D2.A
E1STEP  (via drill 0.6)
  Top 0.61: E1POL.STEP 42.38,25.87 44.29,27.78 44.29,37.3 47.46,40.48 47.46,53.18 v48.73,54.45
  Bottom 0.61: v48.73,54.45 62.7,54.45 63.97,55.72 IC2.25
E2MSFT  (via drill 0.6)
  Top 0.61: R18.1 39.08,24.47 39.21,24.6 43.65,24.6 45.56,26.51 v45.56,31.59
  Bottom 0.61: v45.56,31.59 51.27,31.59 53.81,34.12 67.15,34.12 71.59,38.57 IC2.19
E2STEP  (via drill 0.6)
  Top 0.61: IC2.26 v61.43,60.16 | v65.24,53.81 65.24,29.68 E2POL.STEP
  Bottom 0.61: v61.43,60.16 64.61,60.16 65.24,59.53 v65.24,53.81
ENABLE  (via drill 0.6)
  Top 0.61: 39.84,39.84 39.84,52.54
  Top 0.813: v39.21,38.57 39.21,39.21 39.84,39.84 | 39.84,52.54 41.11,53.81 IC2.34
  Bottom 0.813: ZPOL.EN 41.11,88.1 40.48,88.73 40.48,95.09 39.84,95.72 23.97,95.72 | 23.97,95.72 8.73,95.72 7.46,94.45 7.46,88.73 8.09,88.1 8.73,88.1 | 8.73,88.1 XPOL.EN | YPOL.EN 25.24,88.1 23.97,89.37 23.97,95.72 | IC2.34 41.11,62.06 39.21,63.97 24.6,63.97 20.79,60.16 18.89,60.16 18.25,59.53 8.09,59.53 5.55,62.06 5.55,65.24 6.19,65.88 6.19,85.56 8.73,88.1 | E2POL.EN 69.05,8.73 70.96,6.82 70.96,3.65 69.69,2.38 38.57,2.38 37.3,3.65 37.3,9.36 E1POL.EN 36.67,10.63 37.94,11.9 37.94,37.3 v39.21,38.57
EXT2ADC  (via drill 0.6)
  Top 0.61: IC2.33 43.65,46.83 42.38,45.55 42.38,39.21 39.84,36.66 39.84,34.76 v42.38,32.22 | v40.48,15.08 41.75,15.08 42.38,15.71
  Top 1.27: E2THE.2 C21.+
  Top 1.422: C21.+ 44.92,13.81 43.02,15.71 42.38,15.71 41.75,16.35 41.75,17.49 R12.2
  Bottom 0.61: v42.38,32.22 41.11,32.22 40.48,31.59 v40.48,15.08
EXTADC  (via drill 0.6)
  Top 1.27: E1THE.2 C19.+
  Top 1.422: C19.+ 11.9,14.44 11.27,15.08 11.27,20.79 13.17,22.7 13.17,27.14 v13.81,27.78 R10.2
  Bottom 0.813: v13.81,27.78 13.81,55.08 16.98,58.25 20.16,58.25 23.33,55.08 27.78,55.08 28.41,55.72 IC2.39
EXTMSFT
  Top 0.813: R20.1 20.16,23.33 21.43,24.6 21.43,29.05 22.7,30.32 27.14,30.32 35.4,38.57 35.4,41.75 IC2.5
FANMSFT
  Top 0.813: IC2.27 58.89,59.53 56.99,61.43 56.48,61.43 R13.1
FANOUT1
  Top 1.27: D1.A 59.53,87.47 62.7,84.29 Q6.D
  Top 1.778: D1.A 59.43,92.95 FAN1.2
GND  (via drill 0.6)
  Top 0.61: X1.GND 93.84,84.29 95.09,84.29 95.72,83.66 95.72,81.12 95.09,80.48 95.09,79.84 93.82,78.58 90.64,78.58 90.01,79.21 88.74,79.21 IC1.20 88.74,73.37 | 88.74,73.37 C3.1 | 88.74,73.37 91.66,73.37 C30.- 91.91,72.61 91.91,71.59 90.64,70.32 84.29,70.32 83.66,70.95 83.66,74.13 83.02,74.77 80.48,74.77 80,74.28 VCCOK.C 76.82,74.28 76.03,73.5 76.03,70.32 74.77,69.05 74.77,68.92 C18.2 | 24.6,86.83 34.63,86.83 | 40.48,86.83 51.14,86.83 | C6.2 60.29,29.94 C17.2 | E2POL.GND 51.27,28.41 | 51.27,28.41 50.64,28.41 49.37,29.68 49.37,31.72 C5.2 49.87,32.35 48.1,34.12 47.46,34.12 46.83,34.76 46.83,38.57 47.46,39.21 50.64,39.21 51.27,39.84 IC2.11 51.27,54.45 49.37,56.35 49.37,56.98 IC2.31 | 51.27,28.41 51.91,27.78 Q4.S
  Top 0.813: 48.73,64.1 C23.2 42.25,64.1 38.57,67.78 YPOL.GND | 48.73,64.1 C22.2 | IC2.31 48.73,64.1 | XENDSTOP2.2 9.36,43.02 13.81,47.46 13.81,48.73 14.44,49.37 JP6.6 | XPOL.GND@0 23.33,85.56 24.6,86.83 | 34.63,86.83 C9.1 | YPOL.GND@0 39.21,85.56 40.48,86.83 | 51.14,86.83 C11.1 | ZPOL.GND 61.43,70.32 62.07,70.95 62.07,79.21 60.16,81.12 Q6.S
  Top 1.27: BEDTH.1 76.67,8.73 | 76.67,8.73 C20.- | E2THE.1 C21.- | E1THE.1 C19.- | 67.15,95.09 65.88,96.36 57.62,96.36 56.35,95.09 56.35,90 56.99,89.37 56.99,86.2 | 56.99,86.2 56.35,85.56 ZPOL.GND@0 | 56.99,86.2 56.99,85.56 58.89,83.66 59.53,83.66 Q6.S | C16.1 61.3,13.3 66.51,8.09 76.03,8.09 76.67,8.73
  Top 1.422: ZENDSTOP2.2 6.82,25.23 5.86,26.2 JP18.2 4.61,26.51 2.38,26.51 | JP19.2 5.86,35.09 6.19,34.76 | YENDSTOP2.2 6.82,34.12 6.19,34.76 | 6.19,43.65 5.86,43.98 JP20.2 4.92,48.09 6.09,49.27 SW1.B SW1.B' | XENDSTOP2.2 6.82,43.02 6.19,43.65 | 6.19,43.65 3.65,43.65 2.38,42.38 2.38,35.4 | 2.38,35.4 2.38,26.51 | 6.19,34.76 5.55,34.76 4.92,35.4 2.38,35.4 | C15.1 21.93,85.43 XPOL.GND@0 | C9.1 38.44,85.43 YPOL.GND@0 | C11.1 54.95,85.43 ZPOL.GND@0 | C14.2 21.93,70.19 XPOL.GND | C10.2 38.44,70.19 YPOL.GND | C8.2 54.95,70.19 ZPOL.GND | X1.GND 93.82,91.28 91.28,93.81 89.5,93.81 C4.2 C2.1 86.2,95.09 84.93,96.36 68.42,96.36 67.15,95.09 C1.2 | C19.- 6.19,12.54 2.38,16.35 2.38,26.51 | VREG4.1 85.8,65 v84.29,66.51
  Top 1.676: C12.1 29.55,13.3 34.76,8.09 39.84,8.09 E2THE.1
  Top 1.778: E1POL.GND@0 25.74,13.17 C12.1 | E1POL.GND 25.74,28.41 C13.2 | E2POL.GND 58.76,28.41 C17.2 | E2POL.GND@0 58.76,13.17 C16.1
  Bottom 0.813: 18.25,20.79 20.16,20.79 21.43,22.06 21.43,27.14 22.7,28.41 E1POL.GND
  Bottom 1.016: XPOL.GND 22.06,68.42 23.97,66.51 29.68,66.51 32.22,69.05 32.22,69.69 32.86,70.32 YPOL.GND 38.57,68.42 39.84,67.14 47.46,67.14 50.64,70.32 ZPOL.GND
  Bottom 1.27: E2POL.GND@0 55.08,13.17 54.45,13.81 54.45,15.08 Q4.S 51.91,15.08 51.27,14.44 43.02,14.44 42.38,13.81 C21.- | C20.- 76.67,10.63 77.31,10 79.84,10 81.12,11.27 81.12,27.78 C25.-
  Bottom 1.422: C19.- 9.36,18.25 11.9,20.79 18.25,20.79 18.89,20.16 Q5.S 18.89,14.44 20.16,13.17 E1POL.GND@0 | v84.29,66.51 84.29,71.59 85.56,72.86 C30.-
  Bottom 1.778: 90.64,18.25 Q3.S
  Bottom 3.81: 90.64,18.25 93.18,20.79 VMOT.1 93.18,32.86 89.37,29.05 79.84,29.05 C25.-
  pour Bottom: -5.88,103.34 103.34,103.34 103.34,-3.97 -5.88,-3.97
MCRTS  (via drill 0.6)
  Top 0.813: IC1.11 77.31,76.03 v76.03,76.03 | v17.62,61.43 16.98,62.06 16.98,63.84 C7.2
  Bottom 0.813: v76.03,76.03 56.99,76.03 56.99,69.05 55.72,67.78 50.64,67.78 48.1,65.24 23.97,65.24 20.16,61.43 v17.62,61.43
MCRX  (via drill 0.6)
  Top 0.61: 62.7,54.45 62.7,65.24
  Top 0.813: IC2.15 61.43,53.18 62.7,54.45 | 62.7,65.24 66.51,69.05 v67.15,69.69 | IC1.12 v78.58,79.84
  Bottom 0.813: v78.58,79.84 78.58,75.4 77.31,74.13 71.59,74.13 v67.15,69.69
MCTX  (via drill 0.6)
  Top 0.61: 60.16,55.08 60.16,65.24
  Top 0.813: IC2.14 58.89,53.81 60.16,55.08 | 60.16,65.24 v65.24,70.32 | v67.78,73.5 v67.78,77.94 | v74.13,86.2 75.4,87.47 77.31,87.47 IC1.10
  Bottom 0.813: v65.24,70.32 65.24,70.95 v67.78,73.5 | v67.78,77.94 67.78,83.02 69.69,84.92 72.86,84.92 v74.13,86.2
MCURESET
  Top 0.813: JP6.5 20.16,49.37 20.79,50 20.79,55.72 20.16,56.35 10.73,56.35 10.09,56.98
  Top 1.422: SW1.A 10.09,56.98 SW1.A' 10.09,60.7 10,60.8 | R4.1 6.69,62.83 8.73,60.8 10,60.8 | 10,60.8 12.54,60.8 13.81,62.06 13.81,63.47 C7.1
  Bottom 0.61: JP6.5 19.52,49.37 22.06,46.83 43.02,46.83 46.19,43.65 IC2.9
MISO  (1 unrouted)
  Bottom 0.61: JP6.1 40.48,44.29 41.11,43.65
MOSI
  Top 0.813: JP6.4 15.71,46.83 14.44,45.55 14.44,43.02 15.08,42.38 22.06,42.38 25.87,46.19 37.94,46.19 38.57,45.55 IC2.6
N$1
  Top 0.61: IC1.2 87.47,90.51 86.83,90.51 C2.2 82.52,91.14 81.75,91.91 81.75,92.29 Q1.1
N$2
  Top 0.61: IC1.3 86.2,88.1 84.29,90 72.86,90 72.23,90.64 72.23,92.16 Q1.2 68.55,92.55 C1.1
N$3
  Top 0.61: IC1.5 83.66,84.92 83.02,83.66 74.77,83.66 74.13,83.02 R2.2
N$4
  Top 0.61: IC1.18 86.2,81.12 86.83,81.75 91.81,81.75 X1.D-
N$5
  Top 0.61: IC1.19 87.47,79.84 88.1,80.48 90.64,80.48 91.28,79.84 93.18,79.84 93.82,80.48 X1.D+
N$6
  Top 0.61: IC1.6 82.39,85.56 81.75,84.92 71.59,84.92 70.32,83.66 R3.2
N$7
  Top 0.61: IC1.17 84.93,73.37 C3.2
N$8
  Top 0.813: E2POL.RST E2POL.SLP
N$9
  Top 0.61: R2.1 TXLED.C
N$10
  Top 0.61: R3.1 TXLED1.C
N$11
  Top 0.61: IC2.12 53.81,36.66 | 53.81,36.66 53.81,33.36 C5.1 | Q7.2 53.81,36.66
N$12
  Top 0.61: IC2.13 56.35,36.66 | 56.35,36.66 56.35,33.36 C6.1 | Q7.1 56.35,36.66
N$13
  Top 0.61: IC1.4 84.93,87.47 83.66,88.73 71.09,88.73 R1.1
N$14
  Top 0.813: E1POL.RST E1POL.SLP
N$15
  Top 0.813: ZPOL.RST ZPOL.SLP
N$16
  Top 0.813: YPOL.RST YPOL.SLP
N$17
  Top 0.813: XPOL.RST XPOL.SLP
N$18
  Top 1.422: XPOL.MS1 XPOL.MS2 XPOL.MS3 19.39,80.48 R7.2
N$19
  Top 1.422: YPOL.MS1 YPOL.MS2 YPOL.MS3 35.9,80.48 R5.2
N$20
  Top 1.016: R8.2 35.9,18.12 E1POL.MS3 E1POL.MS2
  Top 1.778: E1POL.MS2 E1POL.MS1
N$21
  Top 1.422: ZPOL.MS1 ZPOL.MS2 ZPOL.MS3 52.41,80.48 R6.2
N$22
  Bottom 1.27: E1POL.1B 32.22,23.33 34.12,21.43 34.12,6.53 JP17.4
N$23
  Bottom 1.27: E1POL.1A 29.68,20.79 31.59,18.89 31.59,5.57 JP17.3
N$24
  Bottom 1.27: E1POL.2A 27.78,18.25 29.05,16.98 29.05,6.5 JP17.2
N$25
  Bottom 1.27: E1POL.2B 25.87,15.71 26.51,15.08 26.51,7.46 JP17.1
N$26
  Bottom 1.27: ZPOL.1B 45.56,75.4 44.29,76.67 44.29,92.2 JP14.4
N$27
  Bottom 1.27: ZPOL.1A 48.1,77.94 46.83,79.21 46.83,93.17 JP14.3
N$28
  Bottom 1.27: ZPOL.2A 50.64,80.48 49.37,81.75 49.37,92.23 JP14.2
N$29
  Bottom 1.27: ZPOL.2B 52.54,83.02 51.91,83.66 51.91,91.28 JP14.1
N$30
  Bottom 1.27: YPOL.2B 36.03,83.02 35.4,83.66 35.4,91.28 JP13.1
N$31
  Bottom 1.27: YPOL.2A 34.12,80.48 32.86,81.75 32.86,92.23 JP13.2
N$32
  Bottom 1.27: YPOL.1A 31.59,77.94 30.32,79.21 30.32,93.17 JP13.3
N$33
  Bottom 1.27: YPOL.1B 29.05,75.4 27.78,76.67 27.78,92.2 JP13.4
N$34  (1 unrouted)
  Bottom 1.27: XPOL.1B 12.54,75.4 11.27,76.67 11.27,91.91 10,93.18
N$35
  Bottom 1.27: XPOL.1A 15.08,77.94 13.81,79.21 13.81,93.17 JP12.3
N$36
  Bottom 1.27: XPOL.2A 17.62,80.48 16.35,81.75 16.35,92.23 JP12.2
N$37
  Bottom 1.27: XPOL.2B 19.52,83.02 18.89,83.66 18.89,91.28 JP12.1
N$38
  pour Top: 0.47,99.53 98.26,100.8 98.26,65.24 69.05,65.24 69.05,1.74 0.47,1.74
N$41
  Top 1.27: R17.2 68.92,18.12 | 68.92,18.12 E2POL.MS3 | 68.92,18.12 68.92,15.84 E2POL.MS2 E2POL.MS1
N$42
  Bottom 1.27: E2POL.1B 65.24,23.33 67.15,21.43 67.15,6.53 JP2.4
N$43
  Bottom 1.27: E2POL.1A 62.7,20.79 64.61,18.89 64.61,5.55 JP2.3
N$44
  Bottom 1.27: E2POL.2A 60.8,18.25 62.07,16.98 62.07,6.5 JP2.2
N$45
  Bottom 1.422: E2POL.2B 58.89,15.71 59.53,15.08 59.53,7.46 JP2.1
N$46
  Top 0.813: Q5.G 13.81,20.79 15.08,22.06 15.08,22.83 R20.2
N$54
  Top 0.813: IC2.32 C23.1
N$55
  Top 0.813: R13.2 56.35,67.78 57.62,69.05 62.07,69.05 63.34,70.32 63.34,79.21 65.24,81.12 Q6.G
N$58
  Top 0.61: C4.1 89.37,89.37 88.74,88.1 IC1.1 88.74,85.56 90.01,84.29 91.81,84.29 X1.VBUS
  Bottom 1.422: X1.VBUS 85.54,84.27 81.12,79.84 JP1.1
N$61
  Top 0.813: Q4.G 46.83,20.16 44.92,22.06 R18.2
N$64
  Top 0.813: R16.1 VCCOK.A
N$67
  Top 0.813: Q3.G 84.29,19.52 82.39,21.43 R21.2
SCK
  Bottom 0.61: JP6.3 20.16,46.83 21.43,45.55 41.75,45.55 43.65,43.65 IC2.8
SCL
  Bottom 0.61: JP6.10 16.22,54.95 17.62,56.35 19.52,56.35 22.06,53.81 22.06,52.54 23.97,50.64 67.15,50.64 67.78,51.27 67.78,59.53 68.42,60.16 70.96,60.16 71.59,59.53 IC2.22
SDA
  Bottom 0.61: JP6.9 19.52,54.45 20.79,53.18 20.79,51.91 23.33,49.37 67.78,49.37 69.05,50.64 IC2.23
SDS
  Bottom 0.61: JP6.7 19.01,51.78 22.7,48.09 43.65,48.09 47.46,44.29 73.5,44.29 74.13,43.65 IC2.20
VCC  (via drill 0.6)
  Top 0.61: R8.1 33.36,20.92 34.76,19.52 37.94,19.52 | R11.1 74.13,16.98 71.59,19.52 60.8,19.52 58.89,21.43 | v45.56,33.49 48.1,32.22 48.1,29.05 50,27.14 v50,25.23 | L1.2 79.21,63.84 R16.2
  Top 0.813: R12.1 39.08,18.38 | 39.08,18.38 37.94,19.52 | v4.92,67.14 6.82,67.14 9.36,64.61 9.36,64.1 R4.2 | TXLED1.A 70.96,71.44 | 70.96,71.44 TXLED.A | 70.96,71.44 70.83,71.31 C18.1 70.83,66.64 71.59,65.88 76.03,65.88 76.8,65.11 R16.2 | ZPOL.VDD 59.53,72.86 v60.8,72.23 | v64.61,72.23 67.15,72.23 67.78,71.59 70.17,71.59 TXLED1.A | TXLED1.A 70.32,71.59 | R10.1 19.52,27.78 19.52,26.51 v20.16,25.87 | 39.08,18.38 39.08,18.76 39.84,19.52 v44.29,19.52
  Top 1.016: 9.36,64.61 10.63,64.61 11.27,63.97 v11.9,63.97
  Top 1.27: R1.2 67.02,85.69 67.78,84.92 67.78,81.12 65.88,79.21 65.88,73.5 v64.61,72.23 | v16.98,36.66 YENDSTOP2.1
  Top 1.422: XPOL.VDD 21.93,72.99 C14.1 R7.1 | YPOL.VDD 38.44,72.99 C10.1 R5.1 | ZPOL.VDD 54.95,72.99 C8.1 R6.1 | VREG4.2 92.55,67.78 92.86,68.1 | 92.86,68.1 94.45,69.69 94.45,72.61 C30.+ | JP1.2 81.93,69.51 83.02,68.42 | 83.02,68.42 92.55,68.42 92.86,68.1 | R16.2 80.99,65.11 81.75,65.88 81.75,67.14 83.02,68.42
  Top 1.778: E1POL.VDD 25.74,25.87 C13.1 R8.1 | E2POL.VDD 58.76,25.87 C17.1 58.89,21.43 R17.1
  Bottom 0.61: v50,25.23 55.08,25.23 55.72,25.87 | IC2.10 48.73,41.75 46.83,39.84 46.19,39.84 45.56,39.21 v45.56,33.49
  Bottom 0.813: 11.27,36.66 11.27,29.68 9.36,27.78 ZENDSTOP2.1 9.36,27.14 11.27,27.14 12.54,25.87 18.89,25.87 | 11.27,36.66 11.27,44.92 10.63,45.55 XENDSTOP2.1 8.73,56.98 4.28,61.43 4.28,66.51 v4.92,67.14 | YENDSTOP2.1 11.27,36.66 | v60.8,72.23 v64.61,72.23 | E1POL.VDD 25.24,27.78 25.24,30.95 24.6,31.59 21.43,31.59 19.52,29.68 19.52,26.51 18.89,25.87 | v20.16,25.87 18.89,25.87 | v44.29,19.52 44.92,19.52 46.83,21.43 53.18,21.43 54.45,22.7 54.45,24.6 55.72,25.87 E2POL.VDD
  Bottom 1.016: v11.9,63.97 11.9,71.59 13.17,72.86 XPOL.VDD 23.33,72.86 23.97,72.23 23.97,69.05 24.6,68.42 29.05,68.42 29.68,69.05 29.68,72.23 30.32,72.86 YPOL.VDD 39.84,72.86 40.48,72.23 40.48,69.05 41.11,68.42 46.19,68.42 46.83,69.05 46.83,72.23 47.46,72.86 ZPOL.VDD
  Bottom 1.27: JP6.2 16.98,44.29 v16.98,36.66
VMOT  (via drill 0.6)
  Top 1.27: 89.97,38.53 81.79,38.53 81.12,39.21 81.12,59.53 v81.75,60.16 85.66,60.16 VREG4.3 | v59.53,74.77 59.53,77.31 v57.62,79.21
  Top 1.422: XPOL.VMOT 21.93,88.23 C15.2 19.52,90.64 | C9.2 38.44,88.23 YPOL.VMOT 36.03,88.1 36.03,90.64 | ZPOL.VMOT 54.95,88.23 C11.2 52.54,90 51.91,90.64 36.03,90.64 | E1POL.VMOT 19.52,10.63 | 36.03,90.64 19.52,90.64 | 19.52,90.64 18.89,90.64
  Top 1.778: E1.1 19.52,10 19.52,10.63 19.52,11.81 D3.C | E2.1 52.54,11.81 D2.C | E1POL.VMOT 25.74,10.63 C12.2 | E2POL.VMOT 58.76,10.63 C16.2 | FAN1.1 62.7,88.2 D1.C
  Top 1.93: C12.2 20.03,10.5 19.52,10 19.52,4.28 20.79,3.01 52.54,3.01 | 52.54,3.01 88.74,3.01 89.37,3.65 89.37,6.78 BED.2 88.83,7.32 D6.C | E2POL.VMOT 53.91,10.63 D2.C | 52.54,11.81 52.54,3.01
  Top 3.81: VMOT.2 89.97,38.53 87.47,36.03 | 87.47,36.03 87.47,27.14 90.64,23.97 93.18,23.97 95.09,22.06 95.09,12.58 BED.2 | 87.47,36.03 79.21,36.03 C25.+
  Bottom 1.27: v81.75,60.16 74.77,60.16 72.23,62.7 64.61,62.7 58.89,68.42 58.89,74.13 v59.53,74.77 | v57.62,79.21 57.62,86.2 55.72,88.1 ZPOL.VMOT
  Bottom 1.422: ZPOL.VMOT 55.08,89.37 56.35,90.64 62.07,90.64 62.7,91.28 FAN1.1
  pour Top: 72.23,0.47 70.96,0.47 70.96,63.34 100.17,63.34 100.17,-0.16 72.23,-0.16
XDIR
  Top 0.813: XPOL.DIR 10,69.69 10,68.42 10.63,67.78 18.89,67.78 20.79,65.88 20.79,63.97 22.7,62.06 30.95,62.06 33.49,59.53 IC2.37
XEND
  Top 0.813: XENDSTOP2.3 23.97,40.48 IC2.1
  Top 1.422: JP20.1 XENDSTOP2.3
XSTEP
  Top 0.813: XPOL.STEP 8.09,72.86 7.46,72.23 7.46,69.69 8.73,68.42 8.73,67.14 9.36,66.51 18.25,66.51 19.52,65.24 19.52,63.34 22.06,60.8 29.68,60.8 30.95,59.53 IC2.38
YDIR
  Top 0.813: YPOL.DIR 25.87,69.69 25.24,69.05 25.24,65.88 26.51,64.61 32.86,64.61 38.57,58.89 IC2.35
YEND
  Top 0.813: YENDSTOP2.3 11.27,31.59 12.54,32.86 18.89,32.86 IC2.2
  Top 1.422: JP19.1 YENDSTOP2.3
YSTEP
  Top 0.813: YPOL.STEP 24.6,72.86 23.97,72.23 23.97,65.24 25.87,63.34 31.59,63.34 36.03,58.89 IC2.36
ZDIR
  Top 0.813: IC2.28 56.35,58.25 54.45,60.16 54.45,66.51 53.18,67.78 43.02,67.78 42.38,68.42 ZPOL.DIR
ZEND
  Top 0.813: ZENDSTOP2.3 10.63,22.7 11.27,23.33 11.27,28.41 13.81,30.95 19.52,30.95 IC2.3
  Top 1.422: JP18.1 ZENDSTOP2.3
ZSTEP
  Top 0.813: IC2.29 53.81,58.89 53.18,59.53 53.18,65.88 52.54,66.51 41.75,66.51 40.48,67.78 40.48,72.23 41.11,72.86 ZPOL.STEP

### Text on the board
bPlace: X-MOTOR | Y-MOTOR | Z-MOTOR | Extruder Fan | USB | Stepper Motor Wiring / 1=BLACK / 2=GREEN / 3=BLUE / 4=RED | X-MIN | 5V | GND | + | 12V IN | SIG | Endstops: | SIG=NO on Switch / GND=C on Switch | Y-MIN | 5V | GND | SIG | - | Z-MIN | 5V | GND | SIG | Heatbed | Hotend | 1 | Hotend | Hotend 2 | Hotend 2 | Thermistor | Heater | Stepper Motor | Thermistor | Heater | Stepper Motor | Bed | Extruder 1 | Extruder 2 | Thermistor
OHSILK: XMOTOR | YMOTOR | ZMOTOR | FAN | 22p | 22p | 12Mhz | 0.1u | 0.1u | 0.1u | 0.1u | EN | EN | D4 | M1 | M1 | M1 | 1K | 10K | 1K | M2 | 2B | M2 | 2B | M2 | 2B | USB | M3 | M3 | M3 | MCP2200 | IRFZ44N | RST | 1K | RST | 1K | RST | 1K | RX | TX | SLP | 1B | SLP | 1B | SLP | 1B | POWER | 0.1u | 0.1u | 0.1u | STEP | STEP | STEP | LEDS | 0.1u | + | 10uF | DIR | DIR | DIR | + | + | + | 0.1u | 7805 | 10K | USBVCC | X | Y | Z | 0.1u | 1K | 0.1u | 0.1u | 10R | wiki. | ATMEGA1284P | RESET | OPENHARDWARE | 10uH | .co.za | 20Mhz | X | LCD/SD | Optional | + | Extruder | Single | 22p | 22p | - + | 100uF | Y | 4K7 | E1 | E2 | 12V 15A IN | DIR | DIR | 0.1u | STEP | 0.1u | STEP | 10R | 10R | 10R | 1B | SLP | 1B | SLP | RST | RST | IRFZ44N | IRFZ44N | IRBL8743 | Z | 4K7 | 4K7 | 1K | M3 | 1K | M3 | 10uF | 2B | M2 | 2B | M2 | D3 | D1 | D2 | M1 | M1 | 0.1u | 0.1u | + | EN | 10uF | + | EN | 10uF | + | ENDSTOPS: | HEATBED | Therm | H/E1 | E1MOTOR | Therm | H/E2 | E2MOTOR | Therm